# Altium schematic sheet MCU.SchDoc
size A4
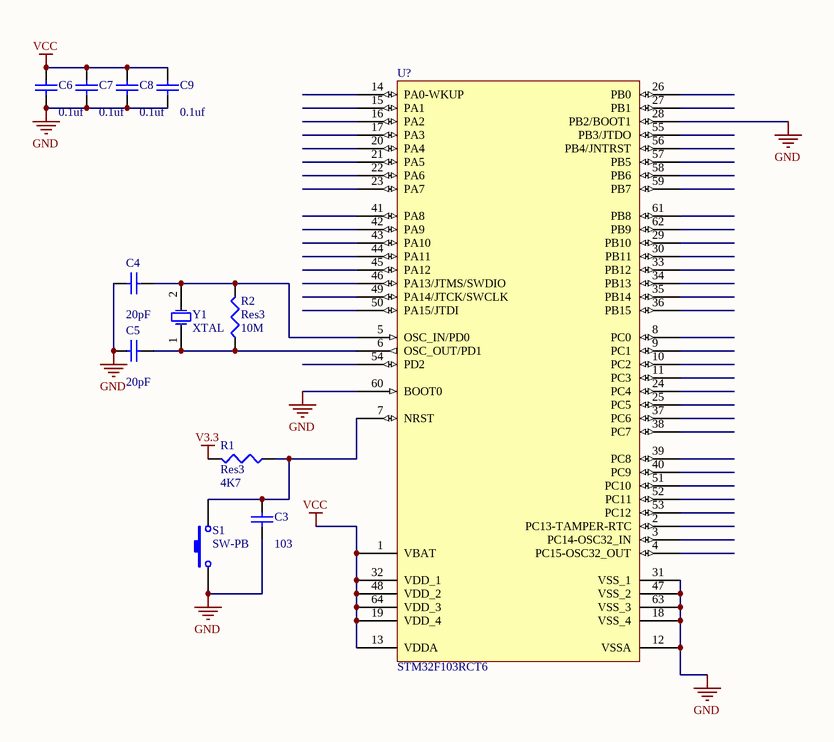
[diagram p0: MCU.SchDoc]

## Parts
C3  value 103  [C1206]
C4  value 20pF  [C1206]  (hidden comment: Cap Semi)
C5  value 20pF  [C1206]  (hidden comment: Cap Semi)
C6  value 0.1uf  [C1206]  (hidden comment: Cap Semi)
C7  value 0.1uf  [C1206]  (hidden comment: Cap Semi)
C8  value 0.1uf  [C1206]  (hidden comment: Cap Semi)
C9  value 0.1uf  [C1206]  (hidden comment: Cap Semi)
R1  Res3  value 4K7  [J1-0603]
R2  Res3  value 10M  [J1-0603]
S1  SW-PB  [PCBComponent_1]
U?  STM32F103RCT6  [LQFP64_N]
Y1  XTAL  [PCBComponent_1]

## Nets
GND: C3.2 C4.1 C5.1 C6.1 C7.1 C8.1 C9.1 S1.1 U?.12(VSSA) U?.18(VSS_4) U?.28(PB2/BOOT1) U?.31(VSS_1) U?.47(VSS_2) U?.60(BOOT0) U?.63(VSS_3)
V3.3: R1.2
VCC: C6.2 C7.2 C8.2 C9.2 U?.1(VBAT) U?.13(VDDA) U?.19(VDD_4) U?.32(VDD_1) U?.48(VDD_2) U?.64(VDD_3)
NetC3_1: C3.1 R1.1 S1.2 U?.7(NRST)
NetC4_2: C4.2 R2.2 U?.5(OSC_IN/PD0) Y1.2(OSC2)
NetC5_2: C5.2 R2.1 U?.6(OSC_OUT/PD1) Y1.1(OSC1)

Not connected (* = marked no-connect by the designer): U? 2(PC13-TAMPER-RTC) 3(PC14-OSC32_IN) 4(PC15-OSC32_OUT) 8(PC0) 9(PC1) 10(PC2) 11(PC3) 14(PA0-WKUP) 15(PA1) 16(PA2) 17(PA3) 20(PA4) 21(PA5) 22(PA6) 23(PA7) 24(PC4) 25(PC5) 26(PB0) 27(PB1) 29(PB10) 30(PB11) 33(PB12) 34(PB13) 35(PB14) 36(PB15) 37(PC6) 38(PC7) 39(PC8) 40(PC9) 41(PA8) 42(PA9) 43(PA10) 44(PA11) 45(PA12) 46(PA13/JTMS/SWDIO) 49(PA14/JTCK/SWCLK) 50(PA15/JTDI) 51(PC10) 52(PC11) 53(PC12) 54(PD2) 55(PB3/JTDO) 56(PB4/JNTRST) 57(PB5) 58(PB6) 59(PB7) 61(PB8) 62(PB9)

## Library data of the parts
C3-C9 = Cap Semi: Capacitor (Semiconductor SIM Model); Published: 8-Jun-2000; LatestRevisionDate: 29-May-2009; LatestRevisionNote: IPC-7351 Footprint Added.; PackageReference: C1206; Publisher: Altium Limited; PackageDescription: Chip Capacitor
R1 R2 = Res3: Resistor; Published: 8-Jun-2000; LatestRevisionDate: 29-May-2009; LatestRevisionNote: IPC-7351 Footprint Added.; PackageReference: J1-0603; Publisher: Altium Limited; PackageDescription: Chip Resistor
S1 = SW-PB: Switch; Published: 24-Mar-1999; LatestRevisionDate: 17-Jul-2002; LatestRevisionNote: Re-released for DXP Platform.; PackageReference: SPST-2; Publisher: Altium Limited; PackageDescription: Switch; 2 Leads
U? = STM32F103RBT6: STM32 ARM-based 32-bit MCU with 128 Kbytes Flash, 64-pin LQFP, Industrial Temperature; Published: 30-May-2008; DatasheetVersion: rev6, Mar-2008; PackageVersion: Mar-2008; PackageReference: LQFP64; Publisher: Altium Limited; PackageDescription: 64-Pin Low-Profile Quad Flat Pack, 10 x 10 mm Body, 0.5 mm Pitch (LQFP64); ComponentLink1Description: Manufacturer Link; ComponentLink1URL: www.st.com/stm32; ComponentLink2Description: Datasheet; ComponentLink2URL: http://www.st.com/stonline/products/literature/ds/13587.pdf
Y1 = XTAL: Crystal Oscillator; Published: 8-Jun-2000; LatestRevisionDate: 17-Jul-2002; LatestRevisionNote: Re-released for DXP Platform.; PackageReference: R38; Publisher: Altium Limited; PackageDescription: Crystal, Thru-Hole; 2 Leads; Body 3.1 x 8.2 mm (Dia.xH)